# Altium schematic sheet MCU.SchDoc
size A; SheetNumber: 3; SheetTotal: 5
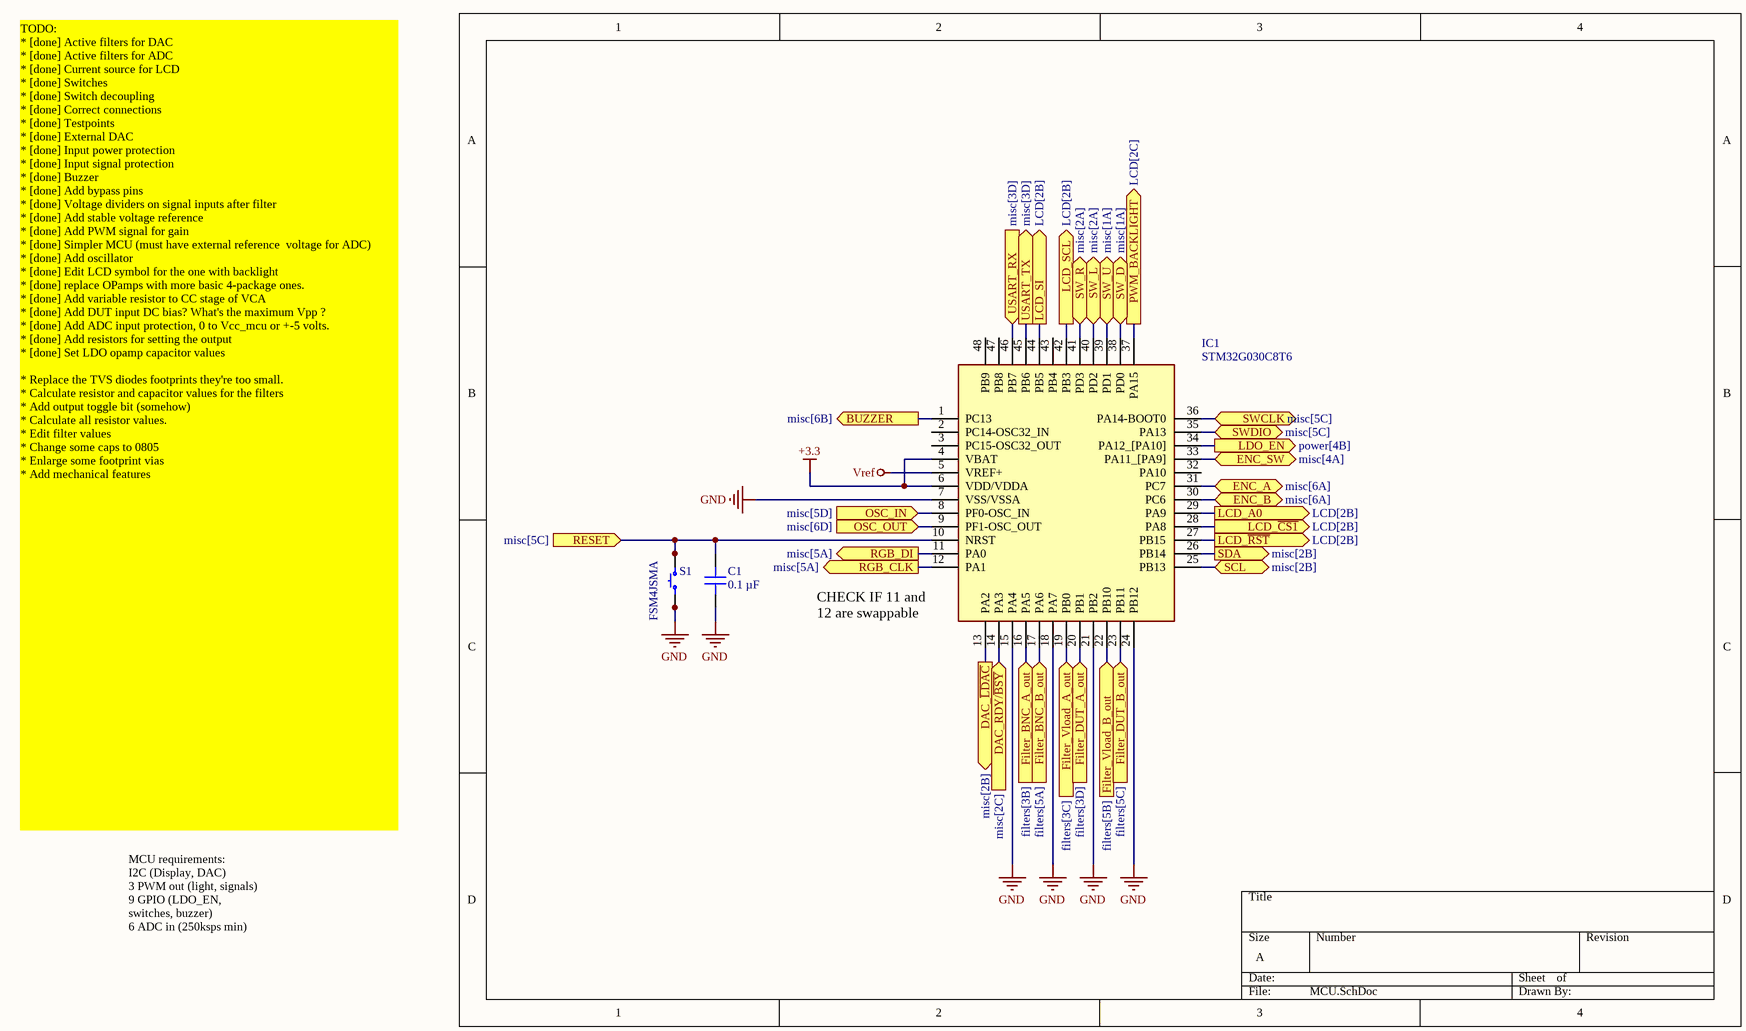
[diagram p0: MCU.SchDoc]

## Parts
C1  0.1 µF  [CAP 1206_3216 - 0.8MM]
IC1  STM32G030C8T6  [QFP50P900X900X160-48N]
S1  FSM4JSMA  [TE FSM4JSMA]

## Ports
BUZZER (out, see misc[6B]), DAC_RDY/~{BSY} (in, see misc[2C]), DAC_~{LDAC} (out, see misc[2B]), ENC_A (bidir, see misc[6A]), ENC_B (bidir, see misc[6A]), ENC_SW (bidir, see misc[4A]), Filter_BNC_A_out (in, see filters[3B]), Filter_BNC_B_out (in, see filters[5A]), Filter_DUT_A_out (in, see filters[3D]), Filter_DUT_B_out (in, see filters[5C]), Filter_Vload_A_out (in, see filters[3C]), Filter_Vload_B_out (in, see filters[5B]), LCD_A0 (out, see LCD[2B]), LCD_SCL (out, see LCD[2B]), LCD_SI (out, see LCD[2B]), LCD_~{CS1} (out, see LCD[2B]), LCD_~{RST} (out, see LCD[2B]), LDO_EN (out, see power[4B]), OSC_IN (in, see misc[5D]), OSC_OUT (in, see misc[6D]), PWM_BACKLIGHT (out, see LCD[2C]), RESET (in, see misc[5C]), RGB_CLK (out, see misc[5A]), RGB_DI (out, see misc[5A]), SCL (bidir, see misc[2B]), SDA (out, see misc[2B]), SW_D (bidir, see misc[1A]), SW_L (bidir, see misc[2A]), SW_R (bidir, see misc[2A]), SW_U (bidir, see misc[1A]), SWCLK (bidir, see misc[5C]), SWDIO (bidir, see misc[5C]), USART_RX (in, see misc[3D]), USART_TX (out, see misc[3D])

## Nets
+3.3: IC1.4(VBAT) IC1.6(VDD/VDDA)
GND: C1.1 IC1.7(VSS/VSSA) IC1.15(PA4) IC1.18(PA7) IC1.21(PB2) IC1.24(PB12) S1.1 S1.2
Vref: IC1.5(VREF+)
BUZZER: IC1.1(PC13) ; port BUZZER
DAC_~{LDAC}: IC1.13(PA2) ; port DAC_~{LDAC}
DAC_RDY/~{BSY}: IC1.14(PA3) ; port DAC_RDY/~{BSY}
ENC_A: IC1.31(PC7) ; port ENC_A
ENC_B: IC1.30(PC6) ; port ENC_B
ENC_SW: IC1.33(PA11_[PA9]) ; port ENC_SW
Filter_BNC_A_out: IC1.16(PA5) ; port Filter_BNC_A_out
Filter_BNC_B_out: IC1.17(PA6) ; port Filter_BNC_B_out
Filter_DUT_A_out: IC1.20(PB1) ; port Filter_DUT_A_out
Filter_DUT_B_out: IC1.23(PB11) ; port Filter_DUT_B_out
Filter_Vload_A_out: IC1.19(PB0) ; port Filter_Vload_A_out
Filter_Vload_B_out: IC1.22(PB10) ; port Filter_Vload_B_out
LCD_A0: IC1.29(PA9) ; port LCD_A0
LCD_~{CS1}: IC1.28(PA8) ; port LCD_~{CS1}
LCD_~{RST}: IC1.27(PB15) ; port LCD_~{RST}
LCD_SCL: IC1.42(PB3) ; port LCD_SCL
LCD_SI: IC1.44(PB5) ; port LCD_SI
LDO_EN: IC1.34(PA12_[PA10]) ; port LDO_EN
OSC_IN: IC1.8(PF0-OSC_IN) ; port OSC_IN
OSC_OUT: IC1.9(PF1-OSC_OUT) ; port OSC_OUT
PWM_BACKLIGHT: IC1.37(PA15) ; port PWM_BACKLIGHT
RESET: C1.2 IC1.10(NRST) S1.3 S1.4 ; port RESET
RGB_CLK: IC1.12(PA1) ; port RGB_CLK
RGB_DI: IC1.11(PA0) ; port RGB_DI
SCL: IC1.25(PB13) ; port SCL
SDA: IC1.26(PB14) ; port SDA
SW_D: IC1.38(PD0) ; port SW_D
SW_L: IC1.40(PD2) ; port SW_L
SW_R: IC1.41(PD3) ; port SW_R
SW_U: IC1.39(PD1) ; port SW_U
SWCLK: IC1.36(PA14-BOOT0) ; port SWCLK
SWDIO: IC1.35(PA13) ; port SWDIO
USART_RX: IC1.46(PB7) ; port USART_RX
USART_TX: IC1.45(PB6) ; port USART_TX

Not connected (* = marked no-connect by the designer): IC1 2(PC14-OSC32_IN) 3(PC15-OSC32_OUT) 32(PA10) 43(PB4) 47(PB8) 48(PB9)

## Notes on the sheet
- (near IC1) CHECK IF 11 and 12 are swappable
- TODO:
  * [done] Active filters for DAC
  * [done] Active filters for ADC
  * [done] Current source for LCD
  * [done] Switches
  * [done] Switch decoupling
  * [done] Correct connections
  * [done] Testpoints
  * [done] External DAC
  * [done] Input power protection
  * [done] Input signal protection
  * [done] Buzzer
  * [done] Add bypass pins
  * [done] Voltage dividers on signal inputs after filter
  * [done] Add stable voltage reference
  * [done] Add PWM signal for gain
  * [done] Simpler MCU (must have external reference  voltage for ADC)
  * [done] Add oscillator
  * [done] Edit LCD symbol for the one with backlight
  * [done] replace OPamps with more basic 4-package ones.
  * [done] Add variable resistor to CC stage of VCA
  * [done] Add DUT input DC bias? What's the maximum Vpp ?
  * [done] Add ADC input protection, 0 to Vcc_mcu or +-5 volts.
  * [done] Add resistors for setting the output
  * [done] Set LDO opamp capacitor values
  * Replace the TVS diodes footprints they're too small.
  * Calculate resistor and capacitor values for the filters
  * Add output toggle bit (somehow)
  * Calculate all resistor values.
  * Edit filter values
  * Change some caps to 0805
  * Enlarge some footprint vias
  * Add mechanical features
- MCU requirements:
  I2C (Display, DAC)
  3 PWM out (light, signals)
  9 GPIO (LDO_EN, switches, buzzer)
  6 ADC in (250ksps min)

## Library data of the parts
C1 = 885012208087: CAP CER 0.1UF 50V X7R 1206; manufacturer: Würth Elektronik; Tolerance: ±10%; Part Number: 885012208087; Capacitance: 0.1 µF; Applications: General Purpose; componentlink1description: Datasheet; componentlink1url: https://katalog.we-online.de/pbs/datasheet/885012208087.pdf; componentlink2description: DigiKey Link; componentlink2url: https://www.digikey.com/en/products/detail/würth-elektronik/885012208087/5453982; Device Package: 1206 (3216 Metric); lastupdated: 6/4/2024 19:10:27; Lifecycle Status: Active; Minimum Order: 1; Mounting Type: Surface Mount, MLCC; Operating Temperature: -55°C ~ 125°C; Package / Case: 1206 (3216 Metric); packaging: TapeAndReel; partid: 20879; Part Status: Active; price: 0.06; series: WCAP-CSGP; Size / Dimension: 0.126" L x 0.063" W (3.20mm x 1.60mm); Supplier 1: DigiKey; Supplier Part Number 1: 732-8127-1-ND; Temperature Coefficient: X7R; Thickness (Max): 0.035" (0.90mm); value: 0.1 µF; Voltage - Rated: 50V
IC1 = STM32G030C8T6: Integrated Circuit; Manufacturer_Name: STMicroelectronics; Datasheet Link: https://componentsearchengine.com/Datasheets/1/STM32G030C8T6.pdf; Height: 1.6mm; Manufacturer_Part_Number: STM32G030C8T6; Mouser Part Number: 511-STM32G030C8T6; Mouser Price/Stock: https://www.mouser.co.uk/ProductDetail/STMicroelectronics/STM32G030C8T6?qs=uwxL4vQweFMKBA8wRRkiWA%3D%3D; Arrow Part Number: STM32G030C8T6; Arrow Price/Stock: https://www.arrow.com/en/products/stm32g030c8t6/stmicroelectronics?utm_currency=USD&region=nac
S1 = FSM4JSMA: SWITCH TACTILE SPST-NO 0.05A 24V; Manufacturer: TE Connectivity ALCOSWITCH Switches; Actuator Height off PCB, Vertical: 5.00mm; Actuator Orientation: Top Actuated; Actuator Type: Standard; Contact Rating @ Voltage: 0.05A @ 24VDC; Illumination: Non-Illuminated; Operating Force: 160gf; Outline: 6.00mm x 6.00mm; Switch Function: Off-Mom; Part Number: FSM4JSMA; Circuit: SPST-NO; ComponentLink1Description: Datasheet; ComponentLink1URL: https://www.te.com/commerce/DocumentDelivery/DDEController?Action=srchrtrv&DocNm=1308111-1_SWITCHES_CORE_PROGRAM_CATALOG&DocType=CS&DocLang=English; ComponentLink2Description: DigiKey Link; ComponentLink2URL: https://www.digikey.com/en/products/detail/te-connectivity-alcoswitch-switches/FSM4JSMA/525821; LastUpdated: 6/3/2024 20:19:31; Lifecycle Status: Active; Minimum Order: 1; Mounting Type: Surface Mount; Operating Temperature: -35°C ~ 85°C; Packaging: Bulk; Part Status: Active; Price: 0.14; Series: FSMJSMA; Supplier 1: DigiKey; Supplier Part Number 1: 450-1129-ND; Termination Style: Gull Wing